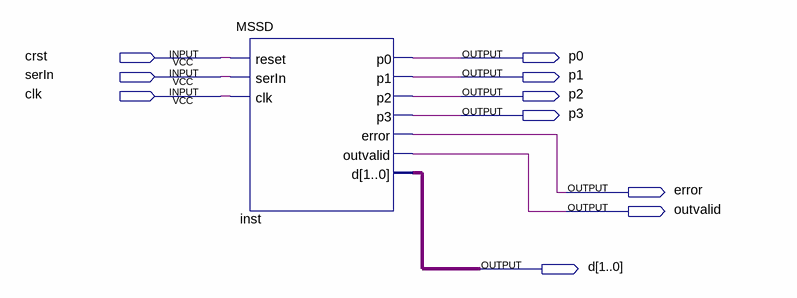
[diagram p0: schematic sheet]
// Quartus schematic MSSD.bdf as structural Verilog: 1 symbols, 10 pins
module MSSD (
  input  crst,
  input  serIn,
  input  clk,
  output p0,
  output p1,
  output p2,
  output p3,
  output error,
  output outvalid,
  output [1:0] d
);

  MSSD inst (
    .reset(crst), .serIn(serIn), .clk(clk), .p0(p0), .p1(p1), .p2(p2), .p3(p3), .error(error),
    .outvalid(outvalid), .d(d));
endmodule
